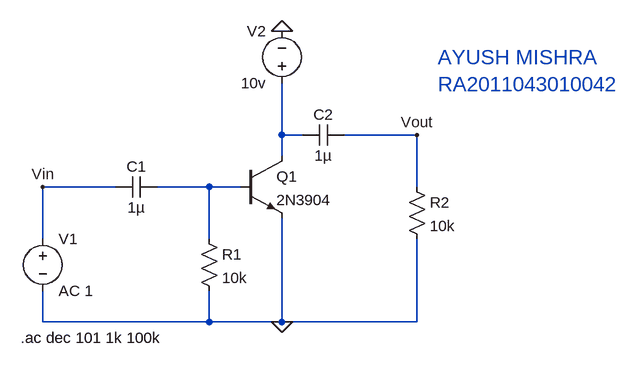
[diagram p0: schematic exp 5b.asc]
exp 5b.asc, the LTspice schematic file:
Version 4
SHEET 1 940 680
WIRE 400 96 400 16
WIRE 432 96 400 96
WIRE 608 96 496 96
WIRE 400 128 400 96
WIRE 144 176 32 176
WIRE 288 176 208 176
WIRE 336 176 288 176
WIRE 608 176 608 96
WIRE 32 256 32 176
WIRE 288 256 288 176
WIRE 32 384 32 336
WIRE 288 384 288 336
WIRE 288 384 32 384
WIRE 400 384 400 224
WIRE 400 384 288 384
WIRE 608 384 608 256
WIRE 608 384 400 384
FLAG 400 -64 0
FLAG 400 384 0
FLAG 32 176 Vin
FLAG 608 96 Vout
SYMBOL voltage 32 240 R0
WINDOW 123 0 0 Left 0
WINDOW 39 0 0 Left 0
SYMATTR InstName V1
SYMATTR Value AC 1
SYMBOL cap 208 160 R90
WINDOW 0 0 32 VBottom 2
WINDOW 3 32 32 VTop 2
SYMATTR InstName C1
SYMATTR Value 1µ
SYMBOL cap 496 80 R90
WINDOW 0 0 32 VBottom 2
WINDOW 3 32 32 VTop 2
SYMATTR InstName C2
SYMATTR Value 1µ
SYMBOL res 272 240 R0
SYMATTR InstName R1
SYMATTR Value 10k
SYMBOL res 592 160 R0
SYMATTR InstName R2
SYMATTR Value 10k
SYMBOL npn 336 128 R0
SYMATTR InstName Q1
SYMATTR Value 2N3904
SYMBOL voltage 400 32 R180
WINDOW 0 24 96 Left 2
WINDOW 3 24 16 Left 2
SYMATTR InstName V2
SYMATTR Value 10v
TEXT -2 408 Left 2 !.ac dec 101 1k 100k
TEXT 640 -24 Left 3 ;AYUSH MISHRA\nRA2011043010042

The netlist it stands for:
* exp 5b.asc
V1 Vin 0 AC 1
C1 N002 Vin 1µ
C2 Vout N001 1µ
R1 N002 0 10k
R2 Vout 0 10k
Q1 N001 N002 0 0 2N3904
V2 N001 0 10v
.model NPN NPN
.model PNP PNP
.lib standard.bjt
.ac dec 101 1k 100k
* AYUSH MISHRA
* RA2011043010042
.backanno
.end